# EAGLE design vusbtiny (EAGLE 7.0.0)
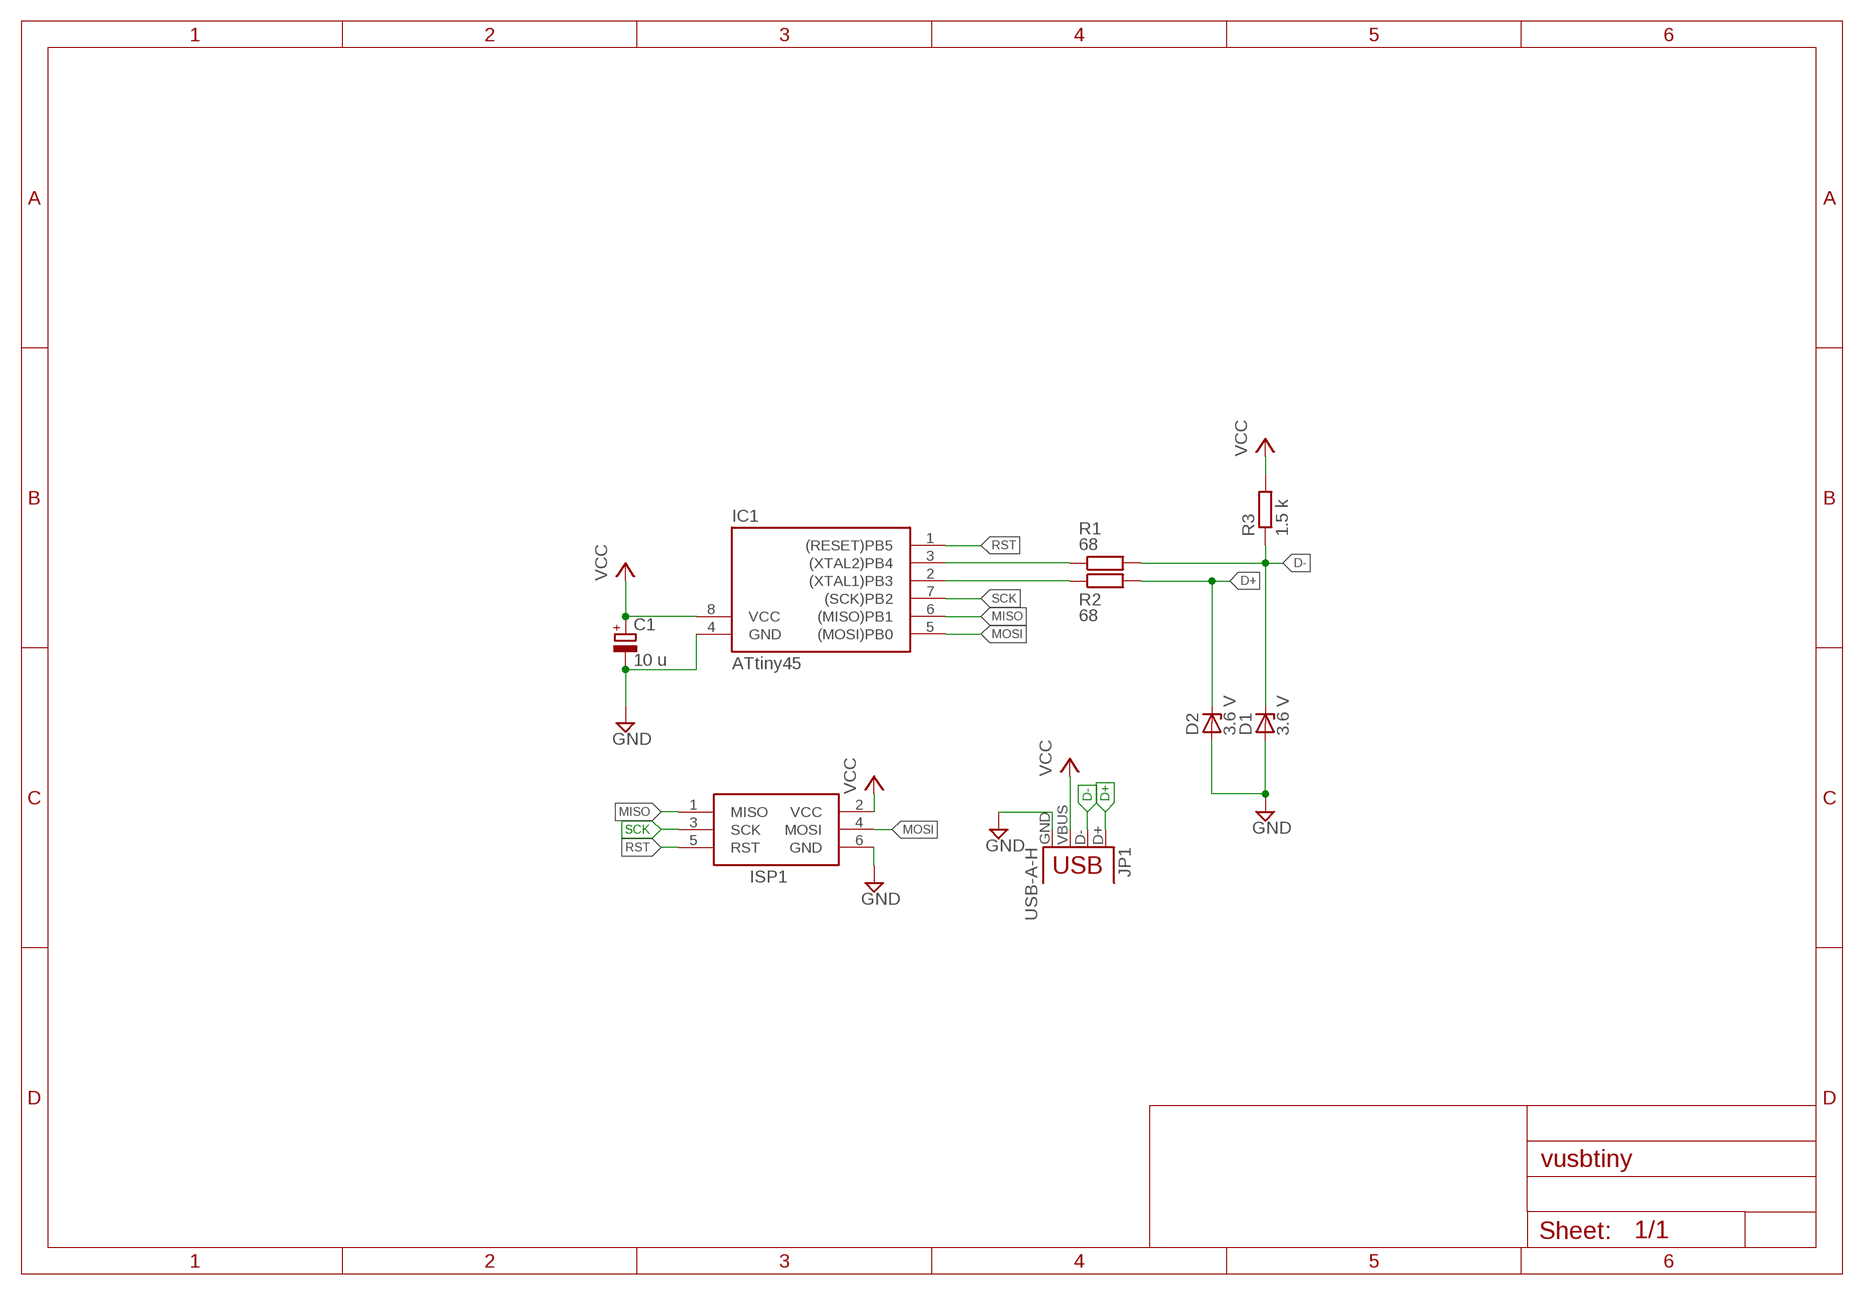
[diagram p0: schematic, sheet 1]

## Parts
C1  10 u  CPOL-EUE2.5-5  [E2,5-5]
D1  3.6 V  BZV10  [DO34Z7]
D2  3.6 V  BZV10  [DO34Z7]
IC1  ATtiny45  TINY12P  [DIL08]
ISP1  AVRISP-6  [AVRISP]
JP1  USB-A-H  [USB-A-H]
R1  68  R-EU_0207/10  [0207/10]
R2  68  R-EU_0207/10  [0207/10]
R3  1.5 k  R-EU_0207/10  [0207/10]

## Nets
D+: D2.C JP1.D+ R2.2
D-: D1.C JP1.D- R1.2 R3.1
GND: C1.- D1.A D2.A IC1.4(GND) ISP1.6(GND) JP1.GND
MISO: IC1.6((MISO)PB1) ISP1.1(MISO)
MOSI: IC1.5((MOSI)PB0) ISP1.4(MOSI)
N$2: IC1.3((XTAL2)PB4) R1.1
N$3: IC1.2((XTAL1)PB3) R2.1
RST: IC1.1((RESET)PB5) ISP1.5(RST)
SCK: IC1.7((SCK)PB2) ISP1.3(SCK)
VCC: C1.+ IC1.8(VCC) ISP1.2(VCC) JP1.VBUS R3.2

## Library data of the parts
C1 = rcl:CPOL-EU: POLARIZED CAPACITOR, European symbol
D1 D2 = diode:BZV10: Z DIODE
IC1 = atmel:TINY12*: MICROCONTROLLER 1 Kbytes FLASH 64 bytes EEPROM; OC_FARNELL: unknown; OC_NEWARK: unknown
ISP1 = adafruit:AVRISP: AVR ISP HEADER Standard 6 pin header for AVR programming
JP1 = SparkFun-Connectors:USB: USB Connectors USB-B-PTH is fully proven SKU : PRT-00139/CONN-08278 USB-miniB is fully proven SKU : PRT-00587 USB-A-PCB is untested. USB-A-H is throughly reviewed, but untested. Spark Fun Electronics SKU : PRT-00437 USB-B-SMT is throughly reviewed, but untested. Needs silkscreen touching up. USB-A-S has not been used/tested USB-MB-H has not been used/tested USB-MICROB has been used. CONN-09505; PROD_ID: CONN-08367
R1-R3 = rcl:R-EU_: RESISTOR, European symbol

## Board
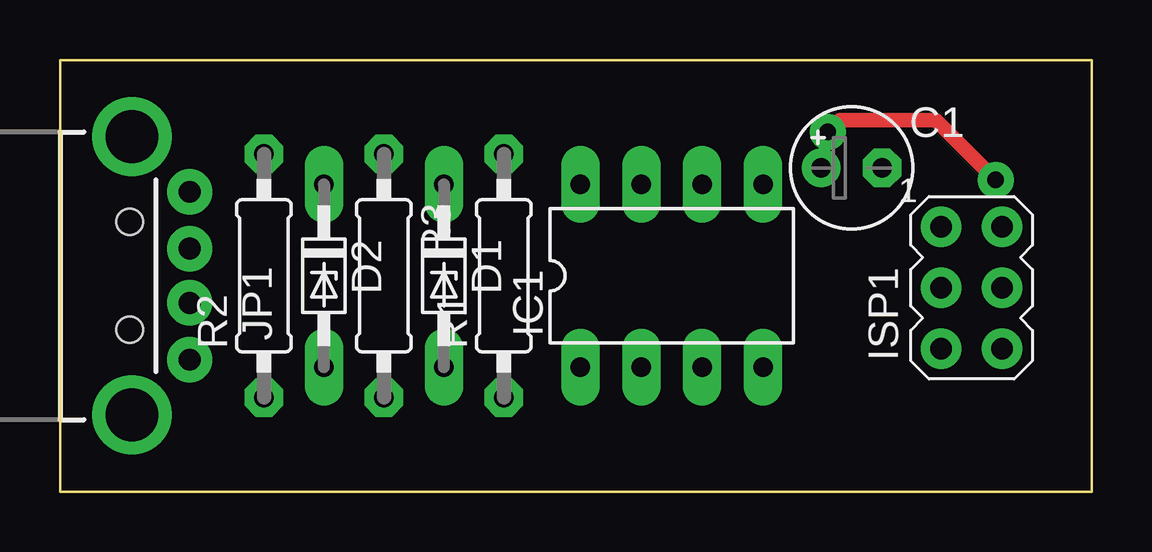
[diagram p1: board, top side]
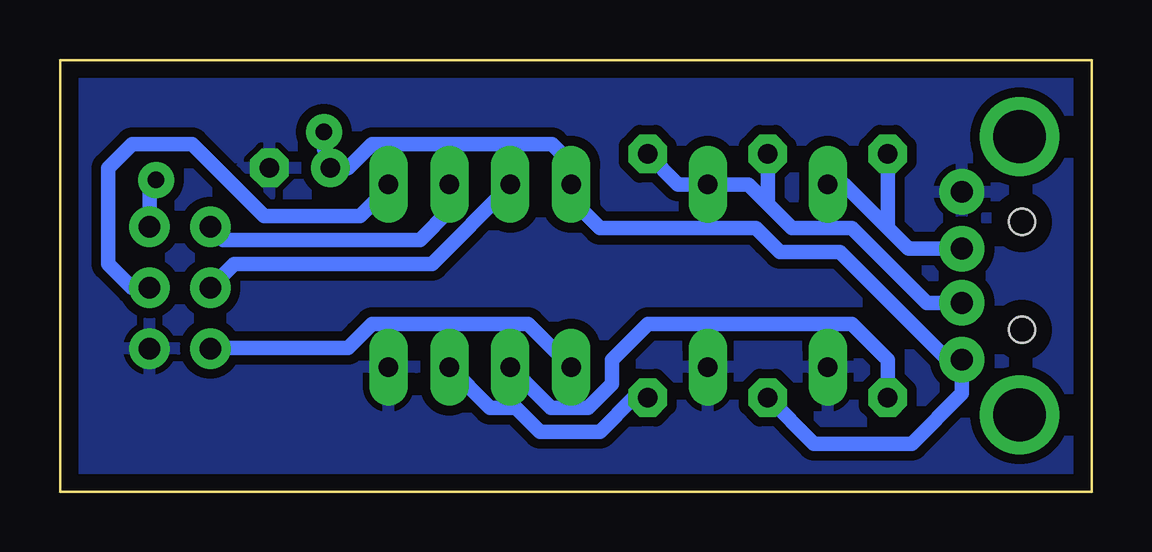
[diagram p2: board, bottom side, seen from below]

Size 43 x 18 mm. Coordinates in mm from the lower left corner, seen from the top.
Outline: 0,0 0,18 43,18 43,0 0,0
Copper layers (1*16): Top 0.035mm / dielectric 1.5mm / Bottom 0.035mm
Design rules "toner_transfer *": minimum track width 0.6mm, minimum drill 0.7mm, track to track 0.4mm, track to pad 0.4mm, pad to pad 0.35mm, via to via 0.4mm, smd to smd 8mil, copper to edge 0.7mm, drill to drill 0.5mm, minimum pad ring 0.4mm, minimum via ring 0.4mm, stop-mask expansion 4mil, vias tented up to drill 0mil, thermal gap 10mil

### Footprints (pad centres in the part's own frame; a part is rotated, then mirrored left to right if it is on the bottom)
E2,5-5 = drill 0.813 pad 1.6: + -1.27,0 | drill 0.813 pad 1.6 octagon: - 1.27,0
DO34Z7 = drill 0.813 long: A 3.81,0; C -3.81,0
DIL08 = drill 0.813 long: 1 -3.81,-3.81; 2 -1.27,-3.81; 3 1.27,-3.81; 4 3.81,-3.81; 5 3.81,3.81; 6 1.27,3.81; 7 -1.27,3.81; 8 -3.81,3.81
AVRISP = drill 0.9 pad 1.626: 1 -1.27,2.54; 2 1.27,2.54; 3 -1.27,0; 4 1.27,0; 5 -1.27,-2.54; 6 1.27,-2.54
USB-A-H = drill 0.914 pad 1.88: D+ 2.4,1.127; D- 2.4,-1.127; GND 2.4,3.5; VBUS 2.4,-3.5 | drill 2.2: GND2 0,-5.8; GND3 0,5.8 | hole 1.1: -0.1,2.25; -0.1,-2.25
0207/10 = drill 0.813 octagon: 1 -5.08,0; 2 5.08,0

### Placement (x,y rotation side)
C1  33,13.5 0 top
D1  16,9 270 top
D2  11,9 270 top
IC1  25.5,9 0 top
ISP1  38,8.5 0 top
JP1  3,9 0 top
R1  18.5,9 90 top
R2  8.5,9 90 top
R3  13.5,9 270 top

### Tracks (layer width: path | path; a pad name or v marks a point on that pad's centre or on a via)
D+
  Bottom 0.6: JP1.D+ 7.63,10.13 8,10.5 | 8,10.5 8.5,11 R2.2 | D2.C 10.31,12.81 8,10.5
D-
  Bottom 0.6: JP1.D- 6.87,7.87 10,11 12.5,11 13,11.5 | 13,11.5 13.5,12 R3.1 | 13,11.5 14.31,12.81 D1.C 17.23,12.81 R1.2
GND
  pour Bottom (isolate 0.4): 0,0 0,18 43,18 43,0
MISO
  Bottom 0.6: ISP1.1 36.19,10.5 28,10.5 26.77,11.73 IC1.6
MOSI
  Bottom 0.6: 35.75,12.75 35.5,12.5 34.5,11.5 30.5,11.5 29.31,12.69 IC1.5 | 35.75,12.75 36,13 | ISP1.4 40,8.5 41,9.5 41,12.5 41,13.5 40,14.5 37.5,14.5 35.75,12.75
N$2
  Bottom 0.6: R1.1 19.08,3.92 20.5,2.5 23,2.5 24,3.5 25.08,3.5 IC1.3
N$3
  Bottom 0.6: IC1.2 22.54,3.5 21,3.5 20,4.5 20,5.5 18.5,7 10,7 8.5,5.5 R2.1
RST
  Bottom 0.6: IC1.1 23,6.5 23.5,7 30,7 30.5,6.5 31,6 36.69,6 ISP1.5
SCK
  Bottom 0.6: IC1.7 24.23,12.77 27.5,9.5 35.73,9.5 ISP1.3
VCC  (via drill 0.7)
  Top 0.6: v39,13 37,15 36.5,15.5 32.5,15.5 v32,15
  Bottom 0.6: R3.2 11.58,2 7.5,2 5.4,4.1 JP1.VBUS 6,5.5 7.5,7 10.5,10 13,10 13.5,10.5 14,11 20.5,11 21,11.5 21.69,12.19 IC1.8 21.69,13.69 22.5,14.5 30,14.5 31,13.5 C1.+ 32,14.27 v32,15 | ISP1.2 39.27,12.73 v39,13